# Altium schematic sheet PMP20873E1_Bias.SchDoc
size 431 x 279 mm; Date: Not shown in title block; ApprovedBy: Not shown in title block; CheckedBy: Not shown in title block; Author: Not shown in title block; CompanyName: Not shown in title block; DrawnBy: Eric Faraci; Engineer: Not shown in title block; Organization: Not shown in title block; Address1: Not shown in title block; Address2: Not shown in title block; Address3: Not shown in title block; Address4: Not shown in title block; DocumentNumber: 1; Revision: Use project parameter SCH_Rev; SheetNumber: 1; SheetTotal: 1; PageSetup: Record=PageOptions|CenterHorizontal=True|CenterVertical=True|PrintScale=0.64|XCorrection=1.00|YCorrection=1.00|PrintKind=0|BorderSize=5000000|LeftOffset=0|BottomOffset=0|Orientation=2|PaperLength=1000|PaperWidth=1000|Scale=100|PaperSource=15|PrintQuality=600|MediaType=1|DitherType=10|PaperKind=Letter|PrintScaleMode=1; CurrentTime: Not shown in title block; CurrentDate: Not shown in title block; Time: Not shown in title block; DocumentFullPathAndName: Not shown in title block; DocumentName: Not shown in title block; ModifiedDate: Not shown in title block; ImagePath: Not shown in title block
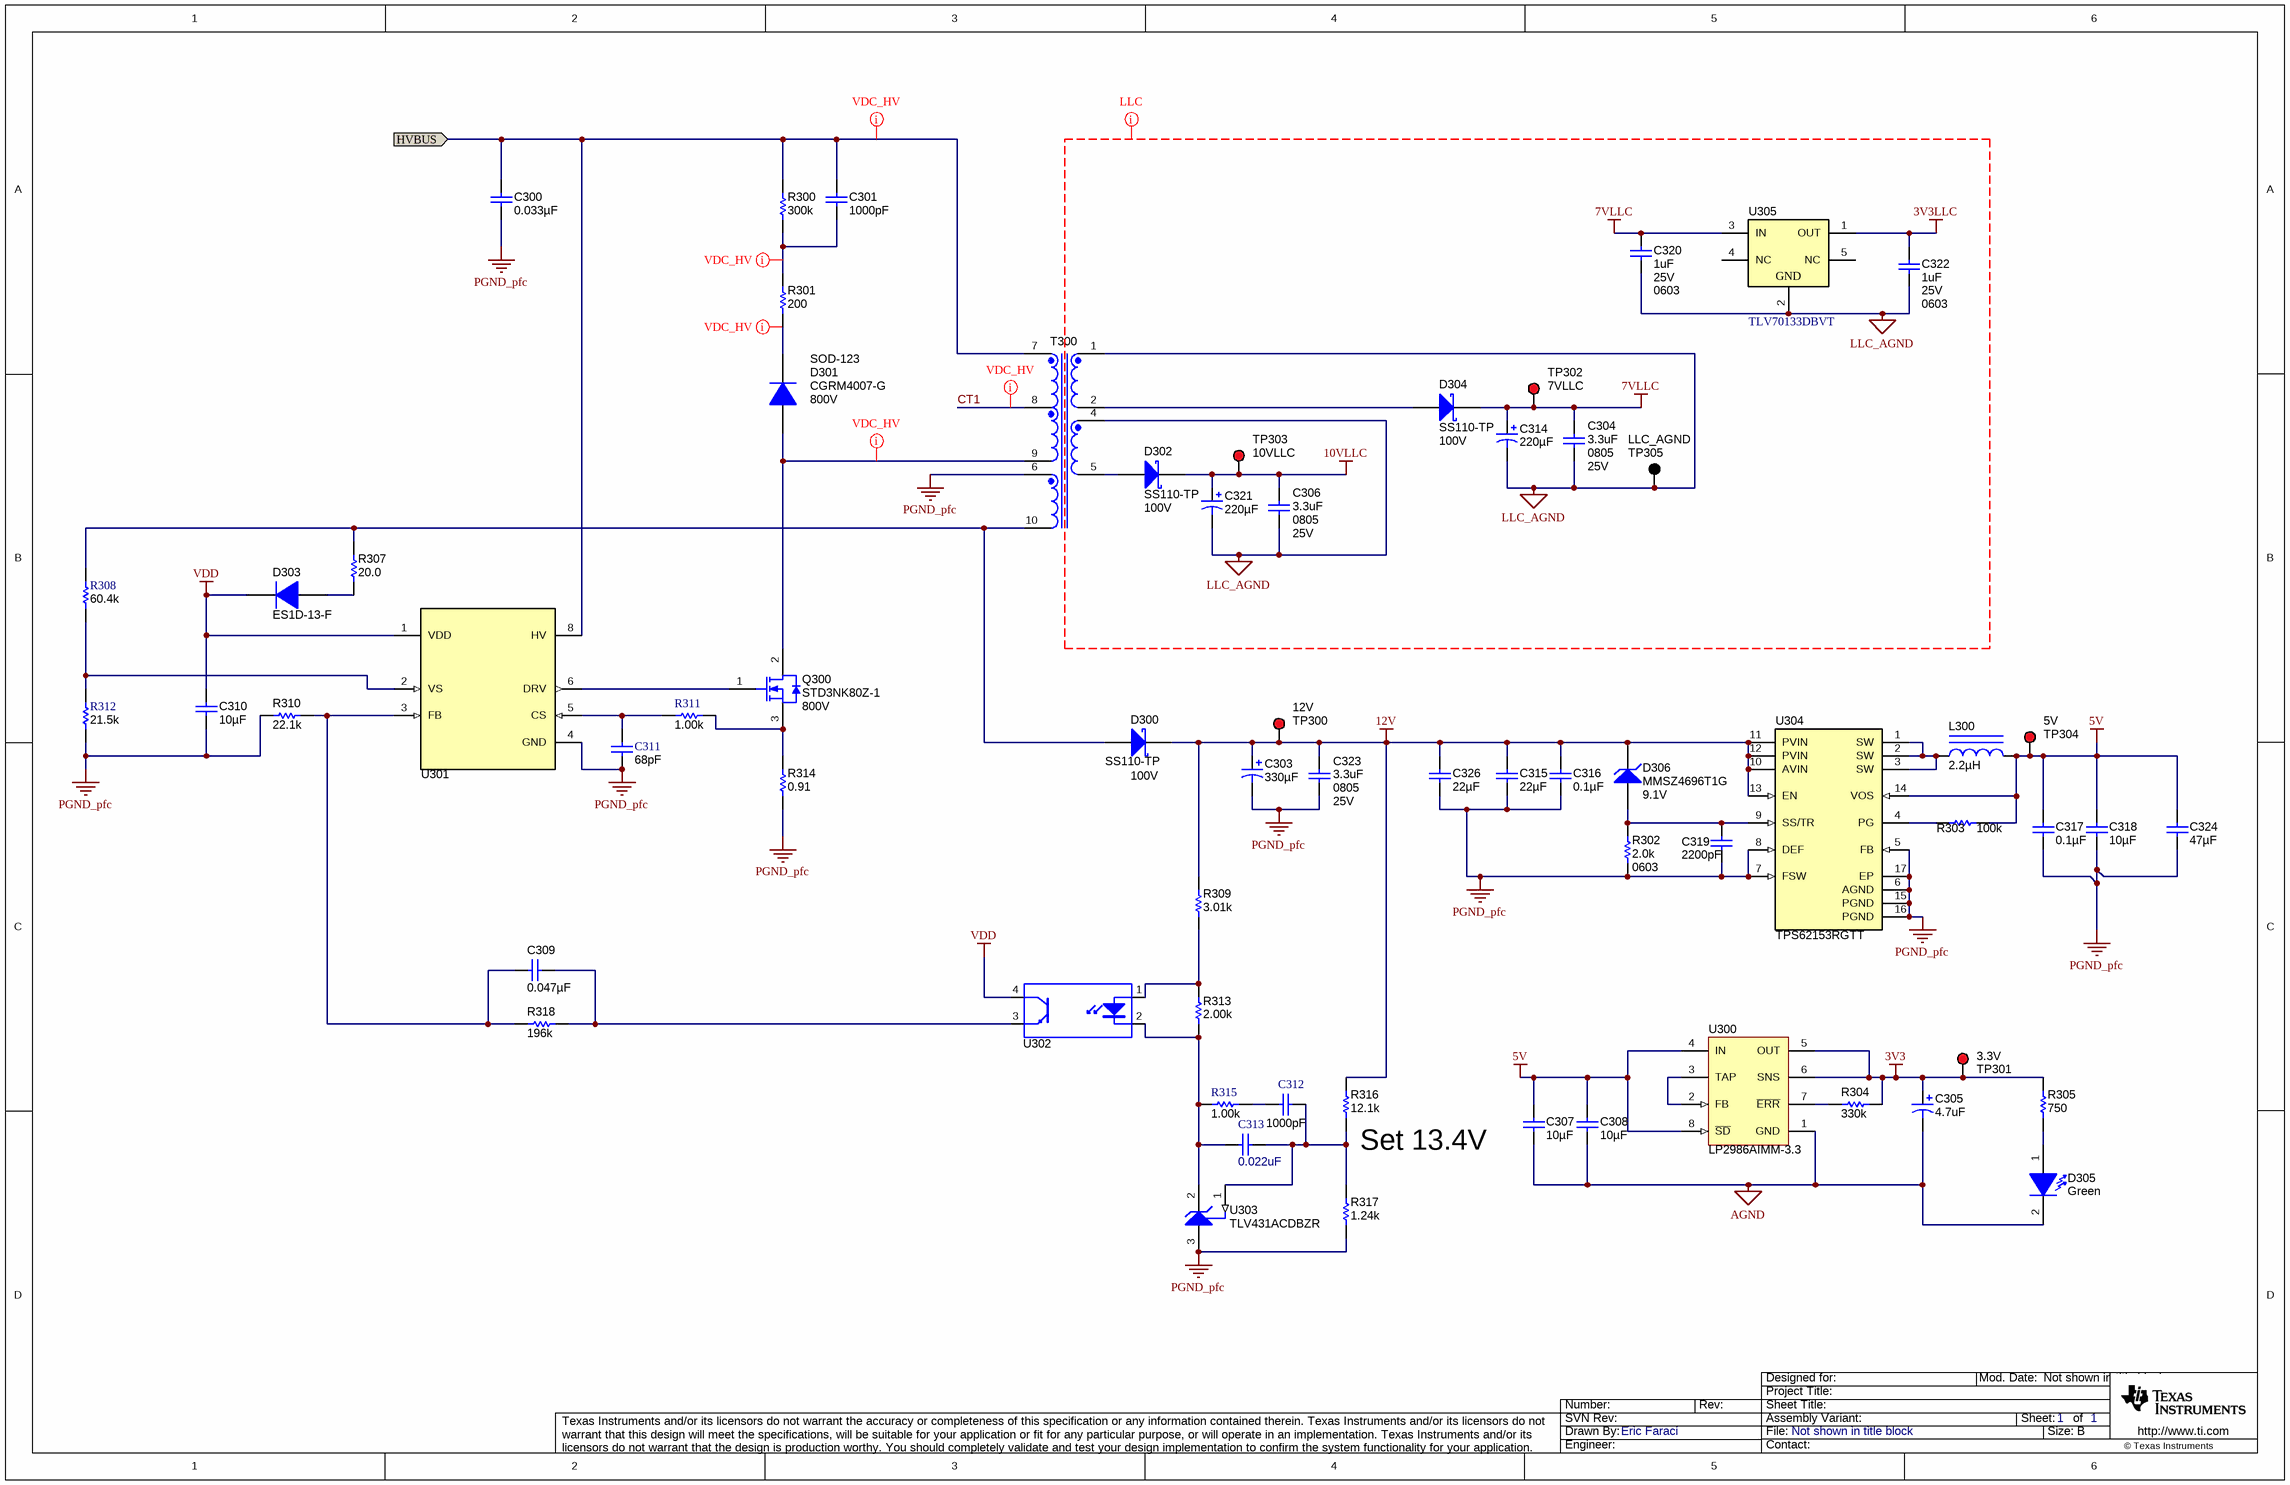
[diagram p0: PMP20873E1_Bias.SchDoc]

## Parts
C300  ValueDisplayed: 0.033µF  [1210]  (hidden comment: GRM32DR72J333KW01L)
C301  ValueDisplayed: 1000pF  [0805_HV]  (hidden comment: C2012X7R2E102K)
C303  ValueDisplayed: 330µF  [ZL_1000x1250]  (hidden comment: 25ZL330MEFC10X12.5)
C304  ValueDisplayed: 3.3uF  PackageReference: 0805  Value2: 25V  [0805_HV]  (hidden comment: GRM21BR71E335KA73L)
C305  ValueDisplayed: 4.7uF  [3528-21]  (hidden comment: 293D475X9010B2TE3)
C306  ValueDisplayed: 3.3uF  PackageReference: 0805  Value2: 25V  [0805_HV]  (hidden comment: GRM21BR71E335KA73L)
C307  ValueDisplayed: 10µF  [0805_HV]  (hidden comment: C0805C106K8PACTU)
C308  ValueDisplayed: 10µF  [0805_HV]  (hidden comment: C0805C106K8PACTU)
C309  ValueDisplayed: 0.047µF  [0805_HV]  (hidden comment: C0805C473K5RACTU)
C310  ValueDisplayed: 10µF  [1206]  (hidden comment: GRM31CR71E106KA12L)
C311  ValueDisplayed: 68pF  [0603]  (hidden comment: 06035A680JAT2A)
C312  ValueDisplayed: 1000pF  [0603]  (hidden comment: 06035A102KAT2A)
C313  ValueDisplayed: 0.022uF  [0603]  (hidden comment: C0603C223K3RACTU)
C314  ValueDisplayed: 220µF  [7361-38]  (hidden comment: TPSV227K016R0050)
C315  ValueDisplayed: 22µF  [1206]  (hidden comment: 1206YD226MAT2A)
C316  ValueDisplayed: 0.1µF  [0402]  (hidden comment: C1005X7R1H104K)
C317  ValueDisplayed: 0.1µF  [0402]  (hidden comment: C1005X7R1H104K)
C318  ValueDisplayed: 10µF  [0805_HV]  (hidden comment: GRM21BR71A106KE51L)
C319  ValueDisplayed: 2200pF  [0402]  (hidden comment: GRM155R71E222KA01D)
C320  ValueDisplayed: 1uF  Value2: 25V  [0603]  (hidden comment: C1608X7R1E105K080AB)
C321  ValueDisplayed: 220µF  [7361-38]  (hidden comment: TPSV227K016R0050)
C322  ValueDisplayed: 1uF  Value2: 25V  [0603]  (hidden comment: C1608X7R1E105K080AB)
C323  ValueDisplayed: 3.3uF  PackageReference: 0805  Value2: 25V  [0805_HV]  (hidden comment: GRM21BR71E335KA73L)
C324  ValueDisplayed: 47µF  [1210]  (hidden comment: 12106D476MAT2A)
C326  ValueDisplayed: 22µF  [1206]  (hidden comment: 1206YD226MAT2A)
D300  SS110-TP  value 100V  [SMA]
D301  CGRM4007-G  Value2: 800V  [SOD-123]
D302  SS110-TP  value 100V  [SMA]
D303  ES1D-13-F  [SMA]
D304  SS110-TP  value 100V  [SMA]
D305  value Green  [LG L29K_GREEN]  (hidden comment: LG L29K-G2J1-24-Z)
D306  MMSZ4696T1G  value 9.1V  [SOD-123]
L300  ValueDisplayed: 2.2µH  [SDR0403]  (hidden comment: SDR0403-2R2ML)
Q300  STD3NK80Z-1  value 800V  [IPAK]
R300  ValueDisplayed: 300k  [1206]  (hidden comment: RC1206FR-07300KL)
R301  ValueDisplayed: 200  [0805_HV]  (hidden comment: ERJ-6GEYJ201V)
R302  value 2.0k  [0603]  (hidden comment: CRCW06032K00JNEA)
R303  value 100k  [0402]  (hidden comment: CRCW0402100KFKED)
R304  ValueDisplayed: 330k  [0603]  (hidden comment: RG1608P-334-B-T5)
R305  ValueDisplayed: 750  [0603]  (hidden comment: RT0603DRE07750RL)
R307  ValueDisplayed: 20.0  [0603]  (hidden comment: RC0603FR-0720RL)
R308  value 60.4k  [0603]  (hidden comment: CRCW060360K4FKEA)
R309  ValueDisplayed: 3.01k  [0805_HV]  (hidden comment: CRCW08053K01FKEA)
R310  ValueDisplayed: 22.1k  [0805_HV]  (hidden comment: CRCW080522K1FKEA)
R311  value 1.00k  [0603]  (hidden comment: CRCW06031K00FKEA)
R312  value 21.5k  [0603]  (hidden comment: CRCW060321K5FKEA)
R313  ValueDisplayed: 2.00k  [0805_HV]  (hidden comment: CRCW08052K00FKEA)
R314  ValueDisplayed: 0.91  [0805_HV]  (hidden comment: CRM0805-FX-R910ELF)
R315  value 1.00k  [0603]  (hidden comment: CRCW06031K00FKEA)
R316  ValueDisplayed: 12.1k  [0805_HV]  (hidden comment: CRCW080512K1FKEA)
R317  ValueDisplayed: 1.24k  [0805_HV]  (hidden comment: CRCW08051K24FKEA)
R318  ValueDisplayed: 196k  [0805_HV]  (hidden comment: ERJ-6ENF1963V)
T300  750315894  [Wurth_750315894]  (value not drawn)
TP300  12V  [Keystone5000]
TP301  3.3V  [Keystone5000]
TP302  7VLLC  [Keystone5000]
TP303  10VLLC  [Keystone5000]
TP304  5V  [Keystone5000]
TP305  LLC_AGND  [Keystone5001]
U300  LP2986AIMM-3.3  [MUA08A_N]
U301  UCC28740DR  [D0007A_N]  (value not drawn)
U302  LTV-817S  [DIP254P762X350-4]  (value not drawn)
U303  TLV431ACDBZR  [DBZ0003A_N]
U304  TPS62153RGTT  [RGT0016C]
U305  TLV70133DBVT  [DBV0005A_N]

## Ports
HVBUS

## Nets
3V3: C305.1(+) R304.2 R305.2 TP301.1 U300.5(OUT) U300.6(SNS)
3V3LLC: C322.2 U305.1(OUT)
5V: C307.1 C308.1 C317.1 C318.2 C324.1 L300.2 R303.2 TP304.1 U300.4(IN) U300.8(~{SD}) U304.14(VOS)
7VLLC: C304.1 C314.1(+) C320.2 D304.1(K) TP302.1 U305.3(IN)
10VLLC: C306.1 C321.1(+) D302.1(K) TP303.1
12V: C303.1(+) C315.1 C316.1 C323.1 C326.1 D300.1(K) D306.1(K) R309.2 R316.2 TP300.1 U304.10(AVIN) U304.11(PVIN) U304.12(PVIN) U304.13(EN)
AGND: C305.2(-) C307.2 C308.2 D305.2(K) U300.1(GND)
LLC_AGND: C304.2 C306.2 C314.2(-) C320.1 C321.2(-) C322.1 T300.1 T300.4 TP305.1 U305.2(GND)
PGND_pfc: C300.2 C303.2(-) C310.2 C311.2 C315.2 C316.2 C317.2 C318.1 C319.2 C323.2 C324.2 C326.2 R302.2 R310.1 R312.1 R314.1 R317.1 T300.6 U301.4(GND) U303.3(ANODE) U304.5(FB) U304.6(AGND) U304.7(FSW) U304.8(DEF) U304.15(PGND) U304.16(PGND) U304.17(EP)
VDD: C310.1 D303.1(K) U301.1(VDD) U302.4(C)
CT1: T300.8
HVBUS: C300.1 C301.1 R300.2 T300.7 U301.8(HV) ; port HVBUS
NetC301_2: C301.2 R300.1 R301.2
NetC309_1: C309.1 R318.2 U302.3(E)
NetC309_2: C309.2 R310.2 R318.1 U301.3(FB)
NetC311_1: C311.1 R311.1 U301.5(CS)
NetC312_1: C312.1 C313.1 R316.1 R317.2 U303.1(REF)
NetC312_2: C312.2 R315.2
NetC313_2: C313.2 R313.1 R315.1 U302.2(K) U303.2(CATHODE)
NetC319_1: C319.1 D306.2(A) R302.1 U304.9(SS/TR)
NetD300_2: D300.2(A) R307.2 R308.2 T300.10
NetD301_1: D301.1(K) R301.1
NetD301_2: D301.2(A) Q300.2(D) T300.9
NetD302_2: D302.2(A) T300.5
NetD303_2: D303.2(A) R307.1
NetD304_2: D304.2(A) T300.2
NetD305_1: D305.1(A) R305.1
NetL300_1: L300.1 U304.1(SW) U304.2(SW) U304.3(SW)
NetQ300_1: Q300.1(G) U301.6(DRV)
NetQ300_3: Q300.3(S) R311.2 R314.2
NetR303_1: R303.1 U304.4(PG)
NetR304_1: R304.1 U300.7(~{ERR})
NetR308_1: R308.1 R312.2 U301.2(VS)
NetR309_1: R309.1 R313.2 U302.1(A)
NetU300_2: U300.2(FB) U300.3(TAP)

Not connected (* = marked no-connect by the designer): U305 4(NC) 5(NC)

## Layout directives
net class VDC_HV: CT1, HVBUS, NetC301_2, NetD301_1, NetD301_2
net class LLC: 3V3LLC, 7VLLC, 10VLLC, LLC_AGND

## Notes on the sheet
- (near R316) Set 13.4V
- Drawn By:
- SVN Rev:
- Number:
- Rev:
- Sheet Title:
- File:
- Project Title:
- Designed for:
- Assembly Variant:
- Mod. Date:
- Sheet:
- Size:
- of
- B
- http://www.ti.com
- Texas Instruments and/or its licensors do not warrant the accuracy or completeness of this specification or any information contained therein. Texas Instruments and/or its licensors do not warrant that this design will meet the specifications, will be suitable for your application or fit for any particular purpose, or will operate in an implementation. Texas Instruments and/or its licensors do not warrant that the design is production worthy. You should completely validate and test your design implementation to confirm the system functionality for your application.
- Engineer:
- Contact:
- © Texas Instruments

## Library data of the parts
C300 = GRM32DR72J333KW01L: CAP, CERM, 0.033 µF, 630 V, +/- 10%, X7R, 1210; Manufacturer: MuRata; Polarized: N; CompType: Capacitor; Value: 0.033uF; U/M: EA; Cap_F: 0.000000033; Tolerance_%: 10; Value1: Unknown; VDC_V: 630; Value2: 630V; TaMin_C: -55; TaMax_C: 125; AEC Category: Q200; SymbolVersion: 2008-07-09; PartNumber: GRM32DR72J333KW01L; PackageReference: 1210; RoHS: Y; MountType: SMT; Technology: Ceramic; TempCo: X7R; Cap_Case: 1210; Published: 2008-06-19; Publisher: Texas Instruments; LatestRevisionDate: 2015-11-24; ComponentLink1Description: Datasheet link; ComponentLink1URL: http://search.murata.co.jp/Ceramy/PnsearchViewAction.do?HnOFG=ON&HnNFG=ON&SEL_CNT=50&sLang=en&sKey=GRM32DR72J333KW01L&x=9&y=9&search=startwith; Supplier 1: Digi-Key; Supplier Part Number 1: 490-3515-1-ND; Supplier 2: Mouser; Supplier Part Number 2: 81-GRM32DR72J333KW01; Supplier 3: Farnell; Supplier Part Number 3: 2057312; AEC Qualified: ?
C301 = C2012X7R2E102K: CAP, CERM, 1000 pF, 250 V, +/- 10%, X7R, 0805; Manufacturer: TDK; Polarized: N; CompType: Capacitor; Value: 1000pF; U/M: EA; Cap_F: 0.000000001; Tolerance_%: 10; ESR_ohm: 0.2815; Value1: 0.2815 ohm; VDC_V: 250; Value2: 250V; TaMin_C: -55; TaMax_C: 125; Cap_Case: 0805; AEC Category: Q200; SymbolVersion: 2008-07-09; PartNumber: C2012X7R2E102K; PackageReference: 0805; RoHS: Y; MountType: SMT; Technology: Ceramic; TempCo: X7R; Published: 2008-06-19; Publisher: Texas Instruments; LatestRevisionDate: 2015-11-24; ComponentLink1Description: Datasheet link; ComponentLink1URL: http://www.tdk.co.jp/tefe02/e412_c.pdf; Supplier 1: Digi-Key; Supplier Part Number 1: 445-2277-1-ND; Supplier 2: Farnell; Supplier Part Number 2: 1844622; AEC Qualified: ?
C303 = 25ZL330MEFC10X12.5: CAP, AL, 330 µF, 25 V, +/- 20%, 0.053 ohm, TH; Manufacturer: Rubycon; Polarized: Y; CompType: Capacitor; Value: 330uF; U/M: EA; Cap_F: 0.00033; Tolerance_%: 20; VDC_V: 25; Value2: 25V; ESR_ohm: 0.053; IRMS_A: 1.03; TaMin_C: -40; TaMax_C: 105; Cap_Case: 10x12.5mm; SymbolVersion: 2008-07-09; PartNumber: 25ZL330MEFC10X12.5; PackageReference: TH, 2-Leads, Body 10x12.5mm, Pin Spacing 5mm; RoHS: Y; Value1: 0.053 ohm; MountType: TH; Technology: AL; Series: ZL; Publisher: Texas Instruments; LatestRevisionDate: 2015-03-25; ComponentLink1Description: Datasheet link; ComponentLink1URL: http://www.rubycon.co.jp/en/catalog/e_pdfs/aluminum/e_ZL.pdf; Supplier 1: Digi-Key; Supplier Part Number 1: 1189-1739-ND
C304 C306 C323 = GRM21BR71E335KA73L: CAP, CERM, 3.3uF, 25V, +/-10%, X7R, 0805; Manufacturer: MuRata; Polarized: N; CompType: Capacitor; U/M: EA; Cap_F: 0.0000033; Tolerance_%: 10; Value1: Unknown; VDC_V: 25; TaMin_C: -55; TaMax_C: 125; SymbolVersion: 2008-07-09; Value: 3.3uF; PartNumber: GRM21BR71E335KA73L; RoHS: Y; MountType: SMT; Technology: Ceramic; TempCo: X7R; Cap_Case: 0805; Published: 2008-06-19; Publisher: Texas Instruments; LatestRevisionDate: 2013-11-25; ComponentLink1Description: Datasheet link; ComponentLink1URL: http://search.murata.co.jp/Ceramy/PnsearchViewAction.do?HnOFG=ON&HnNFG=ON&SEL_CNT=50&sLang=en&sKey=GRM21BR71E335KA73L&x=9&y=9&search=startwith; Supplier 1: Digi-Key; Supplier Part Number 1: GRM21BR71E335KA73L-ND; Supplier 2: Mouser; Supplier Part Number 2: 81-GRM21BR71E335KA3L
C305 = 293D475X9010B2TE3: CAP, TA, 4.7uF, 10V, +/-10%, 3.4 ohm, SMD; Manufacturer: Vishay-Sprague; Polarized: Y; CompType: Capacitor; U/M: EA; Cap_F: 0.0000047; Tolerance_%: 10; Value1: 3.4 ohm; ESR_Ohm: 3.4; IRMS_A: 0.16; TaMin_C: -55; TaMax_C: 125; Cap_Case: B; SymbolVersion: 2008-07-09; Value: 4.7uF; PartNumber: 293D475X9010B2TE3; PackageReference: 3528-21; RoHS: Y; VDC_V: 10; Value2: 10V; MountType: SMT; Technology: TA; Series: 293D; Publisher: Texas Instruments; LatestRevisionDate: 2014-03-08; LatestRevisionNote: Updated supplier links; ComponentLink1Description: Datasheet link; ComponentLink1URL: http://www.vishay.com/docs/40002/293d.pdf; Supplier 1: Digi-Key; Supplier Part Number 1: 718-1147-1-ND; Supplier 2: Mouser; Supplier Part Number 2: 74-293D475X9010B2TE3; Supplier 3: Farnell; Supplier Part Number 3: 1754162
C307 C308 = C0805C106K8PACTU: CAP, CERM, 10 µF, 10 V, +/- 10%, X5R, 0805; Manufacturer: Kemet; Polarized: N; CompType: Capacitor; Value: 10uF; U/M: EA; Cap_F: 0.00001; Tolerance_%: 10; ESR_ohm: 0.003; Value1: 0.003 ohm; Value2: 10V; IRMS_A: 11.43; TaMin_C: -55; TaMax_C: 85; Cap_Case: 0805; SymbolVersion: 2008-07-09; PartNumber: C0805C106K8PACTU; PackageReference: 0805; RoHS: Y; VDC_V: 10; MountType: SMT; Technology: Ceramic; TempCo: X5R; Published: 2008-06-19; Publisher: Texas Instruments; LatestRevisionDate: 2015-03-22; ComponentLink1Description: Datasheet link; ComponentLink1URL: http://www.kemet.com/kemet/web/homepage/kechome.nsf/file/Partial%20Copy%20-%20Ceramic%20Surface%20Mount%20Capacitors/$file/F3102_CE.pdf; Supplier 1: Digi-Key; Supplier Part Number 1: 399-4925-1-ND; Supplier 2: Mouser; Supplier Part Number 2: 80-C0805C106K8P; Supplier 3: Farnell; Supplier Part Number 3: 1463362
C309 = C0805C473K5RACTU: CAP, CERM, 0.047 µF, 50 V, +/- 10%, X7R, 0805; Manufacturer: Kemet; Polarized: N; CompType: Capacitor; Value: 0.047uF; U/M: EA; Cap_F: 0.000000047; Tolerance_%: 10; ESR_ohm: 0.088; Value1: 0.088 ohm; VDC_V: 50; Value2: 50V; IRMS_A: 1.04; TaMin_C: -55; TaMax_C: 125; Cap_Case: 0805; AEC Category: Q200; SymbolVersion: 2008-07-09; PartNumber: C0805C473K5RACTU; PackageReference: 0805; RoHS: Y; MountType: SMT; Technology: Ceramic; TempCo: X7R; Published: 2008-06-19; Publisher: Texas Instruments; LatestRevisionDate: 2015-12-03; ComponentLink1Description: Datasheet link; ComponentLink1URL: http://www.kemet.com/kemet/web/homepage/kechome.nsf/file/Partial%20Copy%20-%20Ceramic%20Surface%20Mount%20Capacitors/$file/F3102_CE.pdf; Supplier 1: Digi-Key; Supplier Part Number 1: 399-1166-1-ND; Supplier 2: Mouser; Supplier Part Number 2: 80-C0805C473K5R; Supplier 3: Farnell; Supplier Part Number 3: 1414697; AEC Qualified: ?
C310 = GRM31CR71E106KA12L: CAP, CERM, 10 µF, 25 V, +/- 10%, X7R, 1206; Manufacturer: MuRata; Polarized: N; CompType: Capacitor; Value: 10uF; U/M: EA; Cap_F: 0.00001; Tolerance_%: 10; Value1: Unknown; VDC_V: 25; Value2: 25V; TaMin_C: -55; TaMax_C: 125; Cap_Case: 2220; AEC Category: Q200; SymbolVersion: 2008-07-09; PartNumber: GRM31CR71E106KA12L; PackageReference: 1206; RoHS: Y; MountType: SMT; Technology: Ceramic; TempCo: X7R; Published: 2008-06-19; Publisher: Texas Instruments; LatestRevisionDate: 2015-12-09; ComponentLink1Description: Datasheet link; ComponentLink1URL: http://search.murata.co.jp/Ceramy/PnsearchViewAction.do?HnOFG=ON&HnNFG=ON&SEL_CNT=50&sLang=en&sKey=GRM31CR71E106KA12L&x=9&y=9&search=startwith; Supplier 1: Mouser; Supplier Part Number 1: 81-GRM31CR71E106KA12; Supplier 2: Farnell; Supplier Part Number 2: 1828837; AEC Qualified: ?
C311 = 06035A680JAT2A: CAP, CERM, 68pF, 50V, +/-5%, C0G/NP0, 0603; Manufacturer: AVX; Polarized: N; CompType: Capacitor; U/M: EA; Cap_F: 0.000000000068; Tolerance_%: 5; ESR_Ohm: 0.144; Value1: 0.144 ohm; VDC_V: 50; TaMin_C: -55; TaMax_C: 125; SymbolVersion: 2008-07-09; Value: 68pF; PartNumber: 06035A680JAT2A; PackageReference: 0603; RoHS: Y; Value2: 50V; MountType: SMT; Technology: Ceramic; TempCo: C0G/NP0; Cap_Case: 0603; Published: 2008-06-19; Publisher: Texas Instruments; LatestRevisionDate: 2014-02-11; ComponentLink1Description: Datasheet link; ComponentLink1URL: http://www.avx.com/docs/masterpubs/smccp.pdf; Supplier 1: Digi-Key; Supplier Part Number 1: 478-1173-1-ND; Supplier 2: Mouser; Supplier Part Number 2: 581-06035A680J; Supplier 3: Farnell; Supplier Part Number 3: 1396268
C312 = 06035A102KAT2A: CAP, CERM, 1000pF, 50V, +/-10%, C0G/NP0, 0603; Manufacturer: AVX; Polarized: N; CompType: Capacitor; U/M: EA; Cap_F: 0.000000001; Tolerance_%: 10; ESR_Ohm: 0.048; Value1: 0.048 ohm; VDC_V: 50; TaMin_C: -55; TaMax_C: 125; SymbolVersion: 2008-07-09; Value: 1000pF; PartNumber: 06035A102KAT2A; PackageReference: 0603; RoHS: Y; Value2: 50V; MountType: SMT; Technology: Ceramic; TempCo: C0G/NP0; Cap_Case: 0603; Published: 2008-06-19; Publisher: Texas Instruments; LatestRevisionDate: 2014-02-11; ComponentLink1Description: Datasheet link; ComponentLink1URL: http://www.avx.com/docs/masterpubs/smccp.pdf; Supplier 1: Digi-Key; Supplier Part Number 1: 478-3718-1-ND; Supplier 2: Mouser; Supplier Part Number 2: 581-06035A102KAT2A; Supplier 3: Farnell; Supplier Part Number 3: 1582693
C313 = C0603C223K3RACTU: CAP, CERM, 0.022uF, 25V, +/-10%, X7R, 0603; Manufacturer: Kemet; Polarized: N; CompType: Capacitor; U/M: EA; Cap_F: 0.000000022; Tolerance_%: 10; Value1: Unknown; VDC_V: 25; TaMin_C: -55; TaMax_C: 125; SymbolVersion: 2008-07-09; Value: 0.022uF; PartNumber: C0603C223K3RACTU; PackageReference: 0603; RoHS: Y; Value2: 25V; MountType: SMT; Technology: Ceramic; TempCo: X7R; Cap_Case: 0603; Published: 2008-06-19; Publisher: Texas Instruments; LatestRevisionDate: 2014-02-11; ComponentLink1Description: Datasheet link; ComponentLink1URL: http://www.kemet.com/kemet/web/homepage/kechome.nsf/vapubfiles/F3102_Y5V.pdf/$file/F3102_Y5V.pdf; Supplier 1: Digi-Key; Supplier Part Number 1: 399-1094-1-ND; Supplier 2: Mouser; Supplier Part Number 2: 80-C0603C223K3R; Supplier 3: Farnell; Supplier Part Number 3: 1204523
C314 C321 = TPSV227K016R0050: CAP, TA, 220 µF, 16 V, +/- 10%, 0.05 ohm, SMD; Manufacturer: AVX; Polarized: Y; CompType: Capacitor; Value: 220uF; U/M: EA; Cap_F: 0.00022; Tolerance_%: 10; VDC_V: 16; Value2: 16V; ESR_ohm: 0.05; IRMS_A: 2.012; TaMin_C: -55; TaMax_C: 125; SymbolVersion: 2008-07-09; PartNumber: TPSV227K016R0050; PackageReference: 7361-38; RoHS: Y; Value1: 0.05 ohm; MountType: SMT; Technology: TA; Series: TPS; Cap_Case: V; Publisher: Texas Instruments; LatestRevisionDate: 2015-03-19; LatestRevisionNote: Updated supplier links; ComponentLink1Description: Datasheet link; ComponentLink1URL: http://www.avx.com/docs/masterpubs/tantniob.pdf; Supplier 1: Digi-Key; Supplier Part Number 1: 478-3327-1-ND; Supplier 2: Mouser; Supplier Part Number 2: 581-TPSV227K016R0050; Supplier 3: Farnell; Supplier Part Number 3: 1135208
C315 C326 = 1206YD226MAT2A: CAP, CERM, 22 µF, 16 V, +/- 20%, X5R, 1206; Manufacturer: AVX; Polarized: N; CompType: Capacitor; Value: 22uF; U/M: EA; Cap_F: 0.000022; Tolerance_%: 20; Value1: Unknown; VDC_V: 16; Value2: 16V; TaMin_C: -55; TaMax_C: 85; AEC Category: Q200; SymbolVersion: 2008-07-09; PartNumber: 1206YD226MAT2A; PackageReference: 1206; RoHS: Y; MountType: SMT; Technology: Ceramic; TempCo: X5R; Cap_Case: 1206; Published: 2008-06-19; Publisher: Texas Instruments; LatestRevisionDate: 2015-10-11; ComponentLink1Description: Datasheet link; ComponentLink1URL: http://www.avx.com/docs/Catalogs/cx5r.pdf; Supplier 1: Digi-Key; Supplier Part Number 1: 478-5332-1-ND; Supplier 2: Mouser; Supplier Part Number 2: 581-1206YD226MAT2A; Supplier 3: Farnell; Supplier Part Number 3: 1833823; AEC Qualified: ?
C316 C317 = C1005X7R1H104K: CAP, CERM, 0.1uF, 50V, +/-10%, C0G/NP0, 0402; Manufacturer: TDK; Polarized: N; CompType: Capacitor; U/M: EA; Cap_F: 0.0000001; Tolerance_%: 10; VDC_V: 50; TaMin_C: -55; TaMax_C: 125; SymbolVersion: 2008-07-09; Value: 0.1uF; PartNumber: C1005X7R1H104K; PackageReference: 0402; RoHS: Y; Value1: ?; Value2: 50V; MountType: SMT; Technology: Ceramic; TempCo: C0G/NP0; Cap_Case: 0402; Published: 2008-06-19; Publisher: Texas Instruments; LatestRevisionDate: 2012-08-23; LatestRevisionNote: Changed publisher; ComponentLink1Description: Datasheet link; Alternate PartNumber: -; Alternate Manufacturer: -; Supplier 1: Digi-Key; Supplier Part Number 1: 445-5932-1-ND
C318 = GRM21BR71A106KE51L: CAP, CERM, 10uF, 10V, +/-10%, X7R, 0805; Manufacturer: MuRata; Polarized: N; CompType: Capacitor; U/M: EA; Cap_F: 0.00001; Tolerance_%: 10; ESR_Ohm: 0.003; Value1: 0.003 ohm; TaMin_C: -55; TaMax_C: 125; Cap_Case: 0805; SymbolVersion: 2008-07-09; Value: 10uF; PartNumber: GRM21BR71A106KE51L; PackageReference: 0805; RoHS: Y; VDC_V: 10; Value2: 10V; MountType: SMT; Technology: Ceramic; TempCo: X7R; Published: 2008-06-19; Publisher: Texas Instruments; LatestRevisionDate: 2014-07-08; ComponentLink1Description: Datasheet link; ComponentLink1URL: http://search.murata.co.jp/Ceramy/PnsearchViewAction.do?HnOFG=ON&HnNFG=ON&SEL_CNT=50&sLang=en&sKey=GRM21BR71A106KE51L&x=9&y=9&search=startwith; Supplier 1: Digi-Key; Supplier Part Number 1: 490-3905-1-ND; Supplier 2: Mouser; Supplier Part Number 2: 81-GRM21BR71A106KE51; Supplier 3: Farnell; Supplier Part Number 3: 1828828
C319 = GRM155R71E222KA01D: CAP, CERM, 2200pF, 25V, +10/%, X7R, 0402; Manufacturer: MuRata; Polarized: N; CompType: Capacitor; U/M: EA; Cap_F: 0.0000000022; Tolerance_%: 10; Value1: Unknown; VDC_V: 25; TaMin_C: -55; TaMax_C: 125; SymbolVersion: 2008-07-09; Value: 2200pF; PartNumber: GRM155R71E222KA01D; PackageReference: 0402; RoHS: Y; Value2: 25V; MountType: SMT; Technology: Ceramic; TempCo: X7R; Cap_Case: 0402; Published: 2008-06-19; Publisher: Texas Instruments; LatestRevisionDate: 2013-01-11; LatestRevisionNote: Changed publisher; ComponentLink1Description: Datasheet link; ComponentLink1URL: http://search.murata.co.jp/Ceramy/PnsearchViewAction.do?HnOFG=ON&HnNFG=ON&SEL_CNT=50&sLang=en&sKey=GRM155R71E222KA01D&x=9&y=9&search=startwith; Supplier 1: Digi-Key; Supplier Part Number 1: 490-5419-1-ND; Supplier 2: Mouser; Supplier Part Number 2: 81-GRM155R71E222KA1D
C320 C322 = C1608X7R1E105K080AB: CAP, CERM, 1uF, 25V, +/-10%, X7R, 0603; Manufacturer: TDK; Polarized: N; CompType: Capacitor; U/M: EA; Cap_F: 0.000001; Tolerance_%: 10; Value1: Unknown; VDC_V: 25; TaMin_C: -55; TaMax_C: 125; SymbolVersion: 2008-07-09; Value: 1uF; PartNumber: C1608X7R1E105K080AB; PackageReference: 0603; RoHS: Y; MountType: SMT; Technology: Ceramic; TempCo: X7R; Cap_Case: 0603; Published: 2008-06-19; Publisher: Texas Instruments; LatestRevisionDate: 2013-05-24; LatestRevisionNote: Changed publisher; ComponentLink1Description: Datasheet link; ComponentLink1URL: http://www.tdk.com/pdf/TDKMLCCCapRange.pdf; Supplier 1: Digi-Key; Supplier Part Number 1: 445-5956-1-ND
C324 = 12106D476MAT2A: CAP, CERM, 47 µF, 6.3 V, +/- 20%, X5R, 1210; Manufacturer: AVX; Polarized: N; CompType: Capacitor; Value: 47uF; U/M: EA; Cap_F: 0.000047; Tolerance_%: 20; Value1: Unknown; VDC_V: 6.3; Value2: 6.3V; TaMin_C: -55; TaMax_C: 85; AEC Category: Q200; SymbolVersion: 2008-07-09; PartNumber: 12106D476MAT2A; PackageReference: 1210; RoHS: Y; MountType: SMT; Technology: Ceramic; TempCo: X5R; Cap_Case: 1210; Published: 2008-06-19; Publisher: Texas Instruments; LatestRevisionDate: 2015-10-11; ComponentLink1Description: Datasheet link; ComponentLink1URL: http://www.avx.com/docs/Catalogs/cx5r.pdf; Supplier 1: Mouser; Supplier Part Number 1: 581-12106D476M; Supplier 2: Farnell; Supplier Part Number 2: 1327743; Supplier 3: Newark; Supplier Part Number 3: 84K8420; AEC Qualified: ?
D300 D302 D304 = 10BQ100TRPBF: Diode, Schottky, 100V, 1A, SMB; Manufacturer: International Rectifier; U/M: EA; Vf_V: 0.78; Value2: 0.78V; Io_A: 1; Vr_V: 100; TJmax_C: 175; RJC_CperW: 36; CompType: Diode; SymbolVersion: 2008-12-08; PartNumber: SS110-TP; PackageReference: SMB; Value1: 1A; MountType: SMT; Type: Schottky; RoHS: Y; Published: 2008-06-26; Publisher: Texas Instruments; LatestRevisionDate: 2013-11-25; ComponentLink1Description: Datasheet link; ComponentLink1URL: http://www.vishay.com/docs/94114/94114.pdf; Supplier 1: Digi-Key; Supplier Part Number 1: VS-10BQ100PBFCT-ND; Supplier 2: Mouser; Supplier Part Number 2: 844-10BQ100TRPBF; Supplier 3: Farnell; Supplier Part Number 3: 1463241
D301 = US1M-13-F: Diode, Ultrafast, 800V, 1A, SMA; Manufacturer: Diodes Inc.; Value: 1.7V; U/M: EA; Vf_V: 1.7; Io_A: 1; Vr_V: 800; TJmax_C: 150; RJC_CperW: 30; CompType: Diode; PartNumber: CGRM4007-G; SymbolVersion: 2008-12-08; MountType: SMT; RoHS: Y; PackageReference: SOD-123; Value1: 1A; Type: Ultrafast; Published: 2008-06-26; Publisher: Texas Instruments; LatestRevisionDate: 2013-05-24; ComponentLink1Description: Datasheet link; ComponentLink1URL: http://www.diodes.com/datasheets/ds16008.pdf; Supplier 1: Digi-Key; Supplier Part Number 1: US1M-FDICT-ND; Supplier 2: Mouser; Supplier Part Number 2: 621-US1M-F; Supplier 3: Farnell; Supplier Part Number 3: 1858603
D303 = ES1D-13-F: Diode, Ultrafast, 200 V, 1 A, SMA; Manufacturer: Diodes Inc.; U/M: EA; Vf_V: 0.92; Value: 200V; Value1: 1A; Value2: 0.92V; Io_A: 1; Vr_V: 200; TJmax_C: 150; RJC_CperW: 25; AEC Category: Q101; SymbolVersion: 2008-12-08; PartNumber: ES1D-13-F; PackageReference: SMA; CompType: Diode; MountType: SMT; Type: Ultrafast; RoHS: Y; Published: 2008-06-26; Publisher: Texas Instruments; LatestRevisionDate: 2015-10-30; ComponentLink1Description: Datasheet link; ComponentLink1URL: http://www.diodes.com/datasheets/ds14001.pdf; Supplier 1: Digi-Key; Supplier Part Number 1: ES1D-FDICT-ND; Supplier 2: Mouser; Supplier Part Number 2: 621-ES1D-F; Supplier 3: Farnell; Supplier Part Number 3: 1858623; AEC Qualified: ?
D305 = LG L29K-G2J1-24-Z: LED, Green, SMD; Manufacturer: OSRAM; Vf_V: 1.7; Value2: 1.7V; Io_A: 0.002; Tjmax_C: 110; Value1: W; U/M: EA; CompType: LED; PartNumber: LG L29K-G2J1-24-Z; SymbolVersion: 2008-12-08; MountType: SMT; RoHS: Y; PackageReference: 1.7x0.65x0.8mm; Type: ?; Color: green; Published: 2008-07-11; Publisher: Texas Instruments; ComponentLink1URL: http://www.osram-os.com/Graphics/XPic2/00077107_0.pdf; ComponentLink1Description: Datasheet link; LatestRevisionDate: 2015-07-24; Supplier 1: Digi-Key; Supplier Part Number 1: 475-2709-1-ND; Supplier 2: Mouser; Supplier Part Number 2: 720-LGL29KG2J124Z
D306 = MMSZ4696T1G: Diode, Zener, 9.1 V, 500 mW, SOD-123; Manufacturer: ON Semiconductor; SymbolCreator: a0412235; U/M: EA; Power_W: 0.5; Vz_V: 9.1; Value1: 0.5W; RJA_CperW: 340; AEC Category: Q101; SymbolVersion: 2010-08-25; PartNumber: MMSZ4696T1G; PackageReference: SOD-123; CompType: Zener; Vr_V: N/A; MountType: SMT; RoHS: Y; ComponentLink1Description: Datasheet link; ComponentLink1URL: http://www.onsemi.com/pub_link/Collateral/MMSZ4678T1-D.PDF; Published: 2008-10-08; Publisher: Texas Instruments; LatestRevisionDate: 2015-10-06; LatestRevisionNote: Updated Supplier Data; Supplier 1: Digi-Key; Supplier Part Number 1: MMSZ4696T1GOSCT-ND; Supplier 2: Mouser; Supplier Part Number 2: 863-MMSZ4696T1G; Supplier 3: Farnell; Supplier Part Number 3: 1390853; AEC Qualified: ?
L300 = SDR0403-2R2ML: Inductor, Drum Core, Ferrite, 2.2 µH, 2.6 A, 0.047 ohm, SMD; Manufacturer: Bourns; Value: 2.2uH; Ind_H: 2.2E-6; Imax_A: 2.6; Irms: 2.6A @ 40C rise; Isat: 3.77A @ 10% inductance drop; DCR_ohm: 0.047; Value2: 2.6A; AEC Category: Q200; SymbolVersion: 2008-07-23; CompType: Inductor; PartNumber: SDR0403-2R2ML; Value1: 0.047 ohm; Technology: Drum Core; MountType: SMT; Material: Ferrite; PackageReference: 4.5x3.2x4mm; Published: 2008-06-26; Publisher: Texas Instruments; LatestRevisionDate: 2016-01-26; ComponentLink1Description: Datasheet link; ComponentLink1URL: http://www.bourns.com/data/global/pdfs/SDR0403.pdf; RoHS: Y; Supplier 1: Digi-Key; Supplier Part Number 1: SDR0403-2R2MLCT-ND; Supplier 2: Mouser; Supplier Part Number 2: 652-SDR0403-2R2ML; Supplier 3: Farnell; Supplier Part Number 3: 1827978; AEC Qualified: ?
Q300 = STD3NK80Z-1: MOSFET, N-CH, 800V, 2.5A, IPAK; Manufacturer: ST Microelectronics; Alternate Manufacturer: None; U/M: EA; ChType: N; VdsMax_V: 800; Value1: 4.5 ohm; Rdson45_Ohm: 4.5; Value2: 19 nC; QgTyp_nC: 19; Vgs_V: 30; IdsMax_A: 2.5; SymbolVersion: 2008-07-28; CompType: MOSFET; PartNumber: STD3NK80Z-1; PackageReference: IPAK; RoHS: Y; MountType: TH; Published: 2008-06-19; Publisher: Texas Instruments; LatestRevisionDate: 2014-01-28; LatestRevisionNote: Added parts.; ComponentLink1Description: Datasheet link; ComponentLink1URL: http://www.st.com/internet/com/TECHNICAL_RESOURCES/TECHNICAL_LITERATURE/DATASHEET/CD00003377.pdf; Supplier 1: Digi-Key; Supplier Part Number 1: 497-12557-5-ND; Supplier 2: Mouser; Supplier Part Number 2: 511-STD3NK80Z-1; Supplier 3: Newark; Supplier Part Number 3: 33R1154
R300 = RC1206FR-07300KL: RES, 300 k, 1%, 0.25 W, 1206; Manufacturer: Yageo America; CompType: Resistor; Value: 300k; Res_ohm: 300000; Tolerance_%: 1; Power_W: 0.25; Value2: 0.25W; VDC_V: 200; TempCo: 100 ppm/C; U/M: EA; AEC Category: Q200; SymbolVersion: 2009-05-29; PartNumber: RC1206FR-07300KL; PackageReference: 1206; RoHS: Y; Value_Code: 300k; Value1: 1%; MountType: SMT; Technology: Thick Film; Published: 2008-06-26; Publisher: Texas Instruments; LatestRevisionDate: 2015-10-21; ComponentLink1Description: Datasheet link; ComponentLink1URL: http://www.yageo.com/pdf/Pu-RC1206_51_PbFree_L_2.pdf; Supplier 1: Digi-Key; Supplier Part Number 1: 311-300KFRCT-ND; Supplier 2: Mouser; Supplier Part Number 2: 603-RC1206FR-07300KL; AEC Qualified: ?
R301 = ERJ-6GEYJ201V: RES, 200, 5%, 0.125 W, 0805; Manufacturer: Panasonic; CompType: Resistor; Value: 200; Value_Code: 200R; Tolerance_%: 5; Power_W: 0.125; Value2: 0.125W; VDC_V: 150; TempCo: 200 ppm/C; EIA_Code: E24; U/M: EA; AEC Category: Q200; SymbolVersion: 2009-05-29; PartNumber: ERJ-6GEYJ201V; PackageReference: 0805; RoHS: Y; Res_ohm: 200; Value1: 5%; MountType: SMT; Technology: Thick Film; Published: 2008-06-26; Publisher: Texas Instruments; LatestRevisionDate: 2015-12-03; ComponentLink1Description: Datasheet link; ComponentLink1URL: http://www.panasonic.com/industrial/components/pdf/AOA0000CE1.pdf; Supplier 1: Digi-Key; Supplier Part Number 1: P200ACT-ND; Supplier 2: Mouser; Supplier Part Number 2: 667-ERJ-6GEYJ201V; Supplier 3: Farnell; Supplier Part Number 3: 2057686; AEC Qualified: ?
R302 = CRCW06032K00JNEA: RES, 2.0k ohm, 5%, 0.1W, 0603; Manufacturer: Vishay-Dale; CompType: Resistor; Res_ohm: 2000; Value_Code: 2k00; Tolerance_%: 5; Power_W: 0.1; VDC_V: 75; TempCo: 200 ppm/C; EIA_Code: E24; U/M: EA; SymbolVersion: 2009-05-29; PartNumber: CRCW06032K00JNEA; PackageReference: 0603; RoHS: Y; Value1: 5%; Value2: 0.1W; MountType: SMT; Technology: Thick Film; Published: 2008-06-26; Publisher: Texas Instruments; LatestRevisionDate: 2013-01-08; ComponentLink1Description: Datasheet link; ComponentLink1URL: http://www.vishay.com/docs/20035/dcrcwe3.pdf; Supplier 1: Mouser; Supplier Part Number 1: 71-CRCW06032K00JNEA; Supplier 2: Farnell; Supplier Part Number 2: 1514727; Supplier 3: Newark; Supplier Part Number 3: 59M6775
R303 = CRCW0402100KFKED: RES, 100k ohm, 1%, 0.063W, 0402; Manufacturer: Vishay-Dale; Alternate PartNumber: Equivalent; Alternate Manufacturer: Any; CompType: Resistor; Res_ohm: 100000; Tolerance_%: 1; Power_W: 0.063; VDC_V: 50; TempCo: 100 ppm/C; EIA_Code: E96; U/M: EA; SymbolVersion: 2009-05-29; PartNumber: CRCW0402100KFKED; PackageReference: 0402; RoHS: Y; Value_Code: 100k; Value1: 1%; Value2: 0.063W; MountType: SMT; Technology: Thick Film; Published: 2008-06-26; Publisher: Texas Instruments; LatestRevisionDate: 2012-10-04; LatestRevisionNote: Changed publisher; ComponentLink1Description: Datasheet link; ComponentLink1URL: http://www.vishay.com/docs/20035/dcrcwe3.pdf; Supplier 1: Digi-Key; Supplier Part Number 1: 541-100KLCT-ND; Supplier 2: Farnell; Supplier Part Number 2: 1150764; Supplier 3: Newark; Supplier Part Number 3: 52K6607
R304 = RG1608P-334-B-T5: RES, 330 k, 0.1%, 0.1 W, 0603; Manufacturer: Susumu Co Ltd; CompType: Resistor; Value: 330k; Res_ohm: 330000; Tolerance_%: 0.1; Value2: 0.1W; VDC_V: 75; TempCo: 25 ppm/C; U/M: EA; AEC Category: Q200; SymbolVersion: 2009-05-29; PartNumber: RG1608P-334-B-T5; PackageReference: 0603; RoHS: Y; Value_Code: 330k; Value1: 0.1%; Power_W: 0.1; MountType: SMT; Technology: Metal Film; Published: 2008-06-26; Publisher: Texas Instruments; LatestRevisionDate: 2015-12-05; ComponentLink1Description: Datasheet link; ComponentLink1URL: http://www.susumu.co.jp/english/pdf/products-j01-01.pdf; Supplier 1: Digi-Key; Supplier Part Number 1: RG16P330KBCT-ND; Supplier 2: Mouser; Supplier Part Number 2: 754-RG1608P-334-B-T5; Supplier 3: Farnell; Supplier Part Number 3: 1797168; AEC Qualified: ?
R305 = RT0603DRE07750RL: RES, 750, 0.5%, 0.1 W, 0603; Manufacturer: Yageo America; CompType: Resistor; Value: 750; Value_Code: 750R; Tolerance_%: 0.5; Power_W: 0.1; Value2: 0.1W; VDC_V: 75; TempCo: 50 ppm/C; EIA_Code: E192; U/M: EA; AEC Category: Q200; SymbolVersion: 2009-05-29; PartNumber: RT0603DRE07750RL; PackageReference: 0603; RoHS: Y; Res_ohm: 750; Value1: 0.5%; MountType: SMT; Technology: Thin Film; Published: 2008-06-26; Publisher: Texas Instruments; LatestRevisionDate: 2015-12-05; ComponentLink1Description: Datasheet link; ComponentLink1URL: http://www.yageo.com/pdf/PYu-RT_1-to-0.05_RoHS_L_3.pdf; AEC Qualified: ?
R307 = RC0603FR-0720RL: RES, 20.0, 1%, 0.1 W, 0603; Manufacturer: Yageo America; CompType: Resistor; Value: 20.0; Res_ohm: 20; Value_Code: 20R0; Tolerance_%: 1; Power_W: 0.1; Value2: 0.1W; VDC_V: 150; TempCo: 200 ppm/C; EIA_Code: E96; U/M: EA; AEC Category: Q200; SymbolVersion: 2009-05-29; PartNumber: RC0603FR-0720RL; PackageReference: 0603; RoHS: Y; Value1: 1%; MountType: SMT; Technology: Thick Film; Published: 2008-06-26; Publisher: Texas Instruments; LatestRevisionDate: 2015-12-05; ComponentLink1Description: Datasheet link; ComponentLink1URL: http://www.yageo.com/pdf/Pu-RC0603_51_PbFree_L_2.pdf; Supplier 1: Digi-Key; Supplier Part Number 1: 311-20.0HRCT-ND; Supplier 2: Mouser; Supplier Part Number 2: 603-RC0603FR-0720RL; Supplier 3: Farnell; Supplier Part Number 3: 1799333; AEC Qualified: ?
R308 = CRCW060360K4FKEA: RES, 60.4k ohm, 1%, 0.1W, 0603; Manufacturer: Vishay-Dale; CompType: Resistor; Res_ohm: 60400; Value_Code: 60k4; Tolerance_%: 1; Power_W: 0.1; VDC_V: 75; TempCo: 100 ppm/C; EIA_Code: E96; U/M: EA; SymbolVersion: 2009-05-29; PartNumber: CRCW060360K4FKEA; PackageReference: 0603; RoHS: Y; Value1: 1%; Value2: 0.1W; MountType: SMT; Technology: Thick Film; Published: 2008-06-26; Publisher: Texas Instruments; LatestRevisionDate: 2014-01-08; ComponentLink1Description: Datasheet link; ComponentLink1URL: http://www.vishay.com/docs/20035/dcrcwe3.pdf; Supplier 1: Digi-Key; Supplier Part Number 1: 541-60.4KHCT-ND; Supplier 2: Mouser; Supplier Part Number 2: 71-CRCW0603-60.4K-E3; Supplier 3: Farnell; Supplier Part Number 3: 1768184
R309 = CRCW08053K01FKEA: RES, 3.01 k, 1%, 0.125 W, 0805; Manufacturer: Vishay-Dale; CompType: Resistor; Value: 3.01k; Res_ohm: 3010; Value_Code: 3k01; Tolerance_%: 1; Power_W: 0.125; Value2: 0.125W; VDC_V: 150; TempCo: 100 ppm/C; EIA_Code: E96; U/M: EA; SymbolVersion: 2009-05-29; PartNumber: CRCW08053K01FKEA; PackageReference: 0805; RoHS: Y; Value1: 1%; MountType: SMT; Technology: Thick Film; Published: 2008-06-26; Publisher: Texas Instruments; LatestRevisionDate: 2014-12-17; ComponentLink1Description: Datasheet link; ComponentLink1URL: http://www.vishay.com/docs/20035/dcrcwe3.pdf; Supplier 1: Digi-Key; Supplier Part Number 1: 541-3.01KCCT-ND; Supplier 2: Mouser; Supplier Part Number 2: 71-CRCW0805-3.01K-E3; Supplier 3: Farnell; Supplier Part Number 3: 1469909
R310 = CRCW080522K1FKEA: RES, 22.1 k, 1%, 0.125 W, 0805; Manufacturer: Vishay-Dale; CompType: Resistor; Value: 22.1k; Res_ohm: 22100; Value_Code: 22k1; Tolerance_%: 1; Power_W: 0.125; Value2: 0.125W; VDC_V: 150; TempCo: 100 ppm/C; EIA_Code: E96; U/M: EA; SymbolVersion: 2009-05-29; PartNumber: CRCW080522K1FKEA; PackageReference: 0805; RoHS: Y; Value1: 1%; MountType: SMT; Technology: Thick Film; Published: 2008-06-26; Publisher: Texas Instruments; LatestRevisionDate: 2014-12-17; ComponentLink1Description: Datasheet link; ComponentLink1URL: http://www.vishay.com/docs/20035/dcrcwe3.pdf; Supplier 1: Digi-Key; Supplier Part Number 1: 541-22.1KCCT-ND; Supplier 2: Mouser; Supplier Part Number 2: 71-CRCW0805-22.1K-E3; Supplier 3: Farnell; Supplier Part Number 3: 1469898
R311 R315 = CRCW06031K00FKEA: RES, 1.00k ohm, 1%, 0.1W, 0603; Manufacturer: Vishay-Dale; CompType: Resistor; Res_ohm: 1000; Value_Code: 1k00; Tolerance_%: 1; Power_W: 0.1; VDC_V: 75; TempCo: 100 ppm/C; EIA_Code: E96; U/M: EA; SymbolVersion: 2009-05-29; PartNumber: CRCW06031K00FKEA; PackageReference: 0603; RoHS: Y; Value1: 1%; Value2: 0.1W; MountType: SMT; Technology: Thick Film; Published: 2008-06-26; Publisher: Texas Instruments; LatestRevisionDate: 2014-01-08; ComponentLink1Description: Datasheet link; ComponentLink1URL: http://www.vishay.com/docs/20035/dcrcwe3.pdf; Supplier 1: Digi-Key; Supplier Part Number 1: 541-1.00KHCT-ND; Supplier 2: Mouser; Supplier Part Number 2: 71-CRCW0603-1.0K-E3; Supplier 3: Farnell; Supplier Part Number 3: 1469740
R312 = CRCW060321K5FKEA: RES, 21.5k ohm, 1%, 0.1W, 0603; Manufacturer: Vishay-Dale; CompType: Resistor; Res_ohm: 21500; Value_Code: 21k5; Tolerance_%: 1; Power_W: 0.1; VDC_V: 75; TempCo: 100 ppm/C; EIA_Code: E96; U/M: EA; SymbolVersion: 2009-05-29; PartNumber: CRCW060321K5FKEA; PackageReference: 0603; RoHS: Y; Value1: 1%; Value2: 0.1W; MountType: SMT; Technology: Thick Film; Published: 2008-06-26; Publisher: Texas Instruments; LatestRevisionDate: 2014-01-08; ComponentLink1Description: Datasheet link; ComponentLink1URL: http://www.vishay.com/docs/20035/dcrcwe3.pdf; Supplier 1: Digi-Key; Supplier Part Number 1: 541-21.5KHCT-ND; Supplier 2: Mouser; Supplier Part Number 2: 71-CRCW0603-21.5K-E3; Supplier 3: Farnell; Supplier Part Number 3: 1469778
R313 = CRCW08052K00FKEA: RES, 2.00 k, 1%, 0.125 W, 0805; Manufacturer: Vishay-Dale; CompType: Resistor; Value: 2.00k; Res_ohm: 2000; Value_Code: 2k00; Tolerance_%: 1; Power_W: 0.125; Value2: 0.125W; VDC_V: 150; TempCo: 100 ppm/C; EIA_Code: E96; U/M: EA; SymbolVersion: 2009-05-29; PartNumber: CRCW08052K00FKEA; PackageReference: 0805; RoHS: Y; Value1: 1%; MountType: SMT; Technology: Thick Film; Published: 2008-06-26; Publisher: Texas Instruments; LatestRevisionDate: 2014-12-17; ComponentLink1Description: Datasheet link; ComponentLink1URL: http://www.vishay.com/docs/20035/dcrcwe3.pdf; Supplier 1: Digi-Key; Supplier Part Number 1: 541-2.00KCCT-ND; Supplier 2: Mouser; Supplier Part Number 2: 71-CRCW0805-2.0K-E3; Supplier 3: Farnell; Supplier Part Number 3: 1469884
R314 = CRM0805-FX-R910ELF: RES, 0.91, 1%, 0.25 W, 0805; Manufacturer: Bourns; CompType: Resistor; Value: 0.91; Value_Code: R910; Tolerance_%: 1; Power_W: 0.25; Value2: 0.25W; VDC_V: 0; TempCo: 100 ppm/C; EIA_Code: E96; U/M: EA; AEC Category: Q200; SymbolVersion: 2009-05-29; PartNumber: CRM0805-FX-R910ELF; PackageReference: 0805; RoHS: Y; Res_ohm: 0.91; Value1: 1%; MountType: SMT; Technology: Film; Published: 2008-06-26; Publisher: Texas Instruments; LatestRevisionDate: 2016-01-06; ComponentLink1Description: Datasheet link; ComponentLink1URL: http://www.bourns.com/data/global/pdfs/CRM0805_1206_2010.pdf; Supplier 1: Mouser; Supplier Part Number 1: 652-CRM0805FXR910ELF; Supplier 2: Farnell; Supplier Part Number 2: 1865238; AEC Qualified: ?
R316 = CRCW080512K1FKEA: RES, 12.1 k, 1%, 0.125 W, 0805; Manufacturer: Vishay-Dale; CompType: Resistor; Value: 12.1k; Res_ohm: 12100; Value_Code: 12k1; Tolerance_%: 1; Power_W: 0.125; Value2: 0.125W; VDC_V: 150; TempCo: 100 ppm/C; EIA_Code: E96; U/M: EA; AEC Category: Q200; SymbolVersion: 2009-05-29; PartNumber: CRCW080512K1FKEA; PackageReference: 0805; RoHS: Y; Value1: 1%; MountType: SMT; Technology: Thick Film; Published: 2008-06-26; Publisher: Texas Instruments; LatestRevisionDate: 2015-09-28; ComponentLink1Description: Datasheet link; ComponentLink1URL: http://www.vishay.com/docs/20035/dcrcwe3.pdf; Supplier 1: Digi-Key; Supplier Part Number 1: 541-12.1KCCT-ND; Supplier 2: Mouser; Supplier Part Number 2: 71-CRCW0805-12.1K-E3; Supplier 3: Farnell; Supplier Part Number 3: 1469866; AEC Qualified: ?
R317 = CRCW08051K24FKEA: RES, 1.24 k, 1%, 0.125 W, 0805; Manufacturer: Vishay-Dale; CompType: Resistor; Value: 1.24k; Res_ohm: 1240; Value_Code: 1k24; Tolerance_%: 1; Power_W: 0.125; Value2: 0.125W; VDC_V: 150; TempCo: 100 ppm/C; EIA_Code: E96; U/M: EA; SymbolVersion: 2009-05-29; PartNumber: CRCW08051K24FKEA; PackageReference: 0805; RoHS: Y; Value1: 1%; MountType: SMT; Technology: Thick Film; Published: 2008-06-26; Publisher: Texas Instruments; LatestRevisionDate: 2014-12-17; ComponentLink1Description: Datasheet link; ComponentLink1URL: http://www.vishay.com/docs/20035/dcrcwe3.pdf; Supplier 1: Digi-Key; Supplier Part Number 1: 541-1.24KCCT-ND; Supplier 2: Mouser; Supplier Part Number 2: 71-CRCW0805-1.24K-E3; Supplier 3: Farnell; Supplier Part Number 3: 1152186
R318 = ERJ-6ENF1963V: RES, 196 k, 1%, 0.125 W, 0805; Manufacturer: Panasonic; CompType: Resistor; Value: 196k; Res_ohm: 196000; Tolerance_%: 1; Power_W: 0.125; Value2: 0.125W; TempCo: 100 ppm/C; EIA_Code: E96; U/M: EA; AEC Category: Q200; SymbolVersion: 2009-05-29; PartNumber: ERJ-6ENF1963V; PackageReference: 0805; RoHS: Y; Value_Code: 196k; Value1: 1%; MountType: SMT; Technology: Thick Film; Published: 2008-06-26; Publisher: Texas Instruments; LatestRevisionDate: 2015-12-03; ComponentLink1Description: Datasheet link; ComponentLink1URL: http://www.panasonic.com/industrial/components/pdf/AOA0000CE2.pdf; Supplier 1: Digi-Key; Supplier Part Number 1: P196KCCT-ND; Supplier 2: Mouser; Supplier Part Number 2: 667-ERJ-6ENF1963V; Supplier 3: Farnell; Supplier Part Number 3: 2057639; AEC Qualified: ?
T300 = 750315894: Transformer, 13 mH, TH; Manufacturer: Wurth Elektronik; SymbolCreator: Altium; Lp: 13000; DCR_ohm: 20.9; LeakageL: 200; Ns1toNp: 0.042; Ns2toNp: 0.035; Rs1: 0.045; Rs2: 0.4; SymbolVersion: 2015-11-25; PartNumber: 750315894; MountType: TH; PackageReference: 14.73x14.73mm; RoHS: Y; ComponentLink1URL: https://sps06.itg.ti.com/sites/KMS/crossdivteams/altium/docs/ComponentDatasheets/750315894r01Spec.pdf; ComponentLink1Description: Datasheet URL; CompType: Transformer; Publisher: Texas Instruments; LatestRevisionDate: 2015-11-30
TP300-TP304 = 5000: Test Point, Miniature, Red, TH; Manufacturer: Keystone; CompType: Test Point Loop; U/M: EA; SymbolVersion: 2008-04-04; PartNumber: 5000; PackageReference: Red Miniature Testpoint; RoHS: Y; MountType: TH; ComponentLink1Description: Datasheet Link; ComponentLink1URL: http://www.keyelco.com/userAssets/file/M60-2p60.pdf; Value: Red; Publisher: Texas Instruments; LatestRevisionDate: 2015-08-25; Supplier 1: Digi-Key; Supplier Part Number 1: 36-5000-ND
TP305 = 5001: Test Point, Miniature, Black, TH; Manufacturer: Keystone; CompType: Test Point Loop; U/M: EA; SymbolVersion: 2008-04-04; PartNumber: 5001; PackageReference: Black Miniature Testpoint; RoHS: Y; MountType: TH; ComponentLink1Description: Datasheet Link; ComponentLink1URL: http://www.keyelco.com/userAssets/file/M60-2p60.pdf; Value: Black; Publisher: Texas Instruments; LatestRevisionDate: 2015-08-25; Supplier 1: Digi-Key; Supplier Part Number 1: 36-5001-ND
U300 = LP2986AIMM-3.3: Micropower, 200 mA Ultra Low-Dropout Fixed or Adjustable Voltage Regulator, 8-pin Mini SOIC; Manufacturer: National Semiconductor; PackageTopMarking: ZXTT*L40A; PowerWise: N; CompType: LDO IC; Published: 4-Dec-2008; DatasheetVersion: Mar-2005; PackageVersion: revF, Apr-2008; PackageReference: MUA08A; Publisher: Altium Limited; PackageDescription: MINI SOIC, .118 x .118 x .034in, 8 Lead, .0256in Pitch; Supplier 1: Farnell; Supplier Part Number 1: 9779981RL; Supplier 2: Farnell; Supplier Part Number 2: 9779981; PartNumber: LP2986AIMM-3.3; RoHS: N; PinCount: 8; Code_JEDEC: MO-187-AA; ComponentLink1Description: LP2986 Datasheet; ComponentLink1URL: http://www.national.com/ds/LP/LP2986.pdf; ComponentLink2Description: LP2986 Web Page; ComponentLink2URL: http://www.national.com/pf/LP/LP2986.html; ComponentLink3Description: MUA08A Package Page; ComponentLink3URL: http://www.national.com/packaging/folders/mua08a.html
U301 = UCC28740DR: Constant-Voltage, Constant-Current Flyback Controller Using Opto-Coupler Feedback, D0007A; Manufacturer: Texas Instruments; SymbolCreator: a0412235; CompType: IC; U/M: EA; SymbolVersion: 2013-01-07; PartNumber: UCC28740DR; Alternate PartNumber: UCC28740D; PackageReference: D0007A; MountType: SMT; ComponentLink1Description: Datasheet Link; ComponentLink1URL: http://www.ti.com/lit/ds/symlink/ucc28740.pdf; RoHS: Y; Publisher: Texas Instruments; LatestRevisionDate: 2015-10-28; Alternate Manufacturer: Texas Instruments
U302 = LTV-817S: Optocoupler, 5 kV, 50-600% CTR, TH-4; Manufacturer: Lite-On; CTR_Min: 50% @ 5mA; CTR_Max: 600% @ 5mA; Voltage_Isolation_Vrms: 5000; tr_typ: 4us; tf_typ: 3us; U/M: EA; CompType: OPTOCOUPLER; SymbolVersion: 2008-11-25; PartNumber: LTV-817S; MountType: SMT; PackageReference: DIP-4; RoHS: Y; ComponentLink1URL: http://optoelectronics.liteon.com/upload/download/DS70-2012-0050/S_110_LTV-817%20(M,%20S,%20S-TA,%20S-TA1,%20S-TP)%20Series%2020130925.pdf; ComponentLink1Description: Datasheet URL; Publisher: Texas Instruments; LatestRevisionDate: 2015-10-26; Supplier 1: Digi-Key; Supplier Part Number 1: 160-1367-5-ND; Supplier 2: Mouser; Supplier Part Number 2: 859-LTV-817S
U303 = TLV431ACDBZR: Low Voltage Adjustable Precision Shunt Regulator, 39 ppm / degC, 15 mA, 0 to 70 degC, 3-pin SOT-23 (DBZ), Green (RoHS & no Sb/Br); Manufacturer: Texas Instruments; Alternate PartNumber: Equivalent; Iout/Iz(Max)(mA): 15; Min Iz for Regulation(uA): 80; Rating: Catalog; SubFamily: Shunt Voltage Reference; Temp Coeff(Max)(ppm/ degree C): 129; Temp Coeff(Typ)(ppm/ degree C): 39; VO Adj(Max)(V): 6; VO Adj(Min)(V): 1.24; DatasheetVersion: SLVS139T; PackageVersion: 4203227/B; PackageReference: DBZ0003A; PackageDescription: 3-Pin Plastic Small Outline, Body 2.92 x 1.3 mm, Pitch 0.95 mm; Supplier 1: Digi-Key; Supplier Part Number 1: 296-18912-2-ND; Supplier 2: Digi-Key; Supplier Part Number 2: 296-18912-1-ND; Supplier 3: Digi-Key; Supplier Part Number 3: 296-18912-6-ND; Supplier 4: Newark; Supplier Part Number 4: 21J9150; Supplier 5: Mouser; Supplier Part Number 5: 595-TLV431ACDBZR; Eco-Plan: Green (RoHS & no Sb/Br); MountType: SMT; Code_JEDEC: TO-236; ComponentLink1Description: Manufacturer URL; ComponentLink1URL: http://www.ti.com/; ComponentLink2Description: Datasheet; ComponentLink2URL: http://www.ti.com/general/docs/lit/getliterature.tsp?genericPartNumber=TLV431A&fileType=pdf; ComponentLink3Description: Package Specification; ComponentLink3URL: http://www.ti.com/litv/pdf/mpds108a; Alternate Manufacturer: Texas Instruments; PartNumber: TLV431ACDBZR
U304 = TPS62153RGTT: Buck Step Down Regulator with 3 to 17 V Input and 5 V Output, -40 to 85 degC, 16-Pin QFN (RGT), Green (RoHS & no Sb/Br); Manufacturer: Texas Instruments; Alternate PartNumber: Equivalent; Duty Cycle(Max)(%): 100; Iout(Max)(A): 1; Iq(Typ)(mA): 0.017; Preset Vout(V): 5; Rating: Catalog; SubFamily: Step-Down Regulator; Switch Current Limit(Typ)(A): 1.7; Synchronous Rectification: TRUE; Vin(Max)(V): 17; Vin(Min)(V): 3; DatasheetVersion: SLVSAL5; PackageVersion: revH, Oct-2011; PackageReference: RGT0016C; PackageDescription: 16-Pin Plastic Quad Flat No-Lead, 3 x 3 mm Body, 0.5 mm Pitch, 1.7 x 1.7 mm Exposed Pad; Supplier 1: Digi-Key; Supplier Part Number 1: 296-30010-2-ND; Supplier 2: Digi-Key; Supplier Part Number 2: 296-30010-1-ND; Supplier 3: Digi-Key; Supplier Part Number 3: 296-30010-6-ND; Supplier 4: Newark; Supplier Part Number 4: 74T5551; Supplier 5: Mouser; Supplier Part Number 5: 595-TPS62153RGTT; Eco-Plan: Green (RoHS & no Sb/Br); Regulated Outputs(#): 1; Topology: Buck; Vout(Max)(V): 5; Vout(Min)(V): 5; MountType: SMT; PartNumber: TPS62153RGTT; Code_JEDEC: MO-220; ComponentLink1Description: Datasheet; ComponentLink1URL: http://www.ti.com/general/docs/lit/getliterature.tsp?genericPartNumber=TPS62153&fileType=pdf; ComponentLink2Description: URL Link1; ComponentLink2URL: Samples URL:http://www.ti.com/product/tps54611#samples; Alternate Manufacturer: Texas Instruments
U305 = TLV70133DBVT: Single Output LDO, 150 mA, Fixed 3.3 V Output, 2.5 to 24 V Input, with Ultra-Low IQ, 5-pin SOT-23 (DBV), -40 to 85 degC, Green (RoHS & no Sb/Br); Manufacturer: Texas Instruments; Alternate PartNumber: Equivalent; Accuracy(%): 2; Fixed Output Options(V): 3.3; Iout(Max)(A): 0.15; Iq(Typ)(mA): 0.032; SubFamily: Single Channel LDO; Vdo(Typ)(mV): 400; Vin(Max)(V): 24; Vin(Min)(V): 2.5; DatasheetVersion: SBVS161; PackageVersion: 4073253-4/K; PackageReference: DBV0005A; PackageDescription: 5-Pin Plastic Small Outline, Body 1.60 Ã— 2.90 mm, Pitch 0.95 mm; Supplier 1: Digi-Key; Supplier Part Number 1: 296-30169-2-ND; Supplier 2: Digi-Key; Supplier Part Number 2: 296-30169-1-ND; Supplier 3: Digi-Key; Supplier Part Number 3: 296-30169-6-ND; Supplier 4: Farnell; Supplier Part Number 4: 2078547; Supplier 5: Newark; Supplier Part Number 5: 82T9713; Supplier 6: Mouser; Supplier Part Number 6: 595-TLV70133DBVT; Eco-Plan: Green (RoHS & no Sb/Br); Vout Adj(Max)(V): 3.3; Vout Adj(Min)(V): 3.3; MountType: SMT; Code_JEDEC: MO-178; PartNumber: TLV70133DBVT; ComponentLink1Description: Manufacturer URL; ComponentLink1URL: http://www.ti.com/; ComponentLink2Description: Datasheet; ComponentLink2URL: http://www.ti.com/general/docs/lit/getliterature.tsp?genericPartNumber=TLV70133&fileType=pdf; ComponentLink3Description: Package Specification; ComponentLink3URL: http://www.ti.com/litv/pdf/mpds018i; Alternate Manufacturer: Texas Instruments